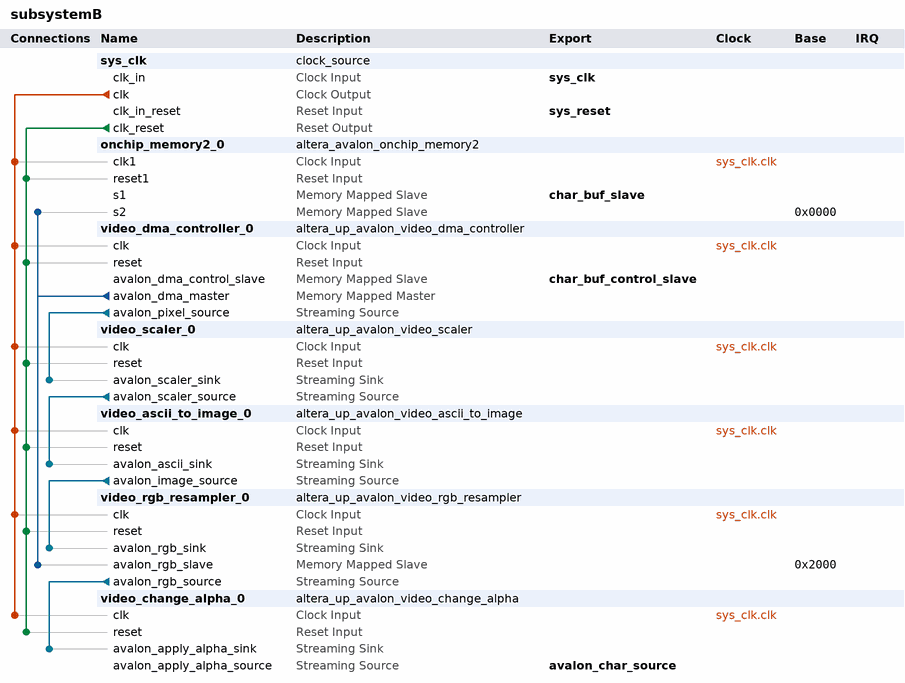
[diagram p0: system contents]
# Platform Designer (Qsys) system subsystemB, Cyclone IV E EP4CE115F29C7
# Parameters at their usual value, and those the tool derives, are not listed.
package require -exact qsys 18.0
create_system subsystemB
set_project_property DEVICE_FAMILY {Cyclone IV E}
set_project_property DEVICE EP4CE115F29C7

add_instance sys_clk clock_source 18.1
set_instance_parameter_value sys_clk clockFrequency 50000000
set_instance_parameter_value sys_clk clockFrequencyKnown false

add_instance onchip_memory2_0 altera_avalon_onchip_memory2 18.1
set_instance_parameter_value onchip_memory2_0 dataWidth 32
set_instance_parameter_value onchip_memory2_0 dualPort true
set_instance_parameter_value onchip_memory2_0 initMemContent true
set_instance_parameter_value onchip_memory2_0 initializationFileName onchip_mem.hex
set_instance_parameter_value onchip_memory2_0 memorySize 8192
set_instance_parameter_value onchip_memory2_0 singleClockOperation true

add_instance video_dma_controller_0 altera_up_avalon_video_dma_controller 18.0
set_instance_parameter_value video_dma_controller_0 addr_mode X-Y
set_instance_parameter_value video_dma_controller_0 back_start_address 150994944
set_instance_parameter_value video_dma_controller_0 color_bits 8
set_instance_parameter_value video_dma_controller_0 color_planes 1
set_instance_parameter_value video_dma_controller_0 dma_enabled true
set_instance_parameter_value video_dma_controller_0 height 60
set_instance_parameter_value video_dma_controller_0 mode {From Memory to Stream}
set_instance_parameter_value video_dma_controller_0 start_address 150994944
set_instance_parameter_value video_dma_controller_0 width 80

add_instance video_scaler_0 altera_up_avalon_video_scaler 18.0
set_instance_parameter_value video_scaler_0 color_bits 8
set_instance_parameter_value video_scaler_0 color_planes 1
set_instance_parameter_value video_scaler_0 height_in 60
set_instance_parameter_value video_scaler_0 height_scaling 8
set_instance_parameter_value video_scaler_0 include_channel true
set_instance_parameter_value video_scaler_0 width_in 80
set_instance_parameter_value video_scaler_0 width_scaling 8

add_instance video_ascii_to_image_0 altera_up_avalon_video_ascii_to_image 18.0
set_instance_parameter_value video_ascii_to_image_0 colour_format {1-bit Black/White}

add_instance video_rgb_resampler_0 altera_up_avalon_video_rgb_resampler 18.0
set_instance_parameter_value video_rgb_resampler_0 alpha 1023
set_instance_parameter_value video_rgb_resampler_0 input_type {1-bit Black/White}
set_instance_parameter_value video_rgb_resampler_0 output_type {40-bit RGBA}

add_instance video_change_alpha_0 altera_up_avalon_video_change_alpha 18.0
set_instance_parameter_value video_change_alpha_0 alpha 0
set_instance_parameter_value video_change_alpha_0 color 0
set_instance_parameter_value video_change_alpha_0 color_bits 10
set_instance_parameter_value video_change_alpha_0 color_planes 4

# connections
add_connection sys_clk.clk onchip_memory2_0.clk1 clock
add_connection sys_clk.clk video_ascii_to_image_0.clk clock
add_connection sys_clk.clk video_change_alpha_0.clk clock
add_connection sys_clk.clk video_dma_controller_0.clk clock
add_connection sys_clk.clk video_rgb_resampler_0.clk clock
add_connection sys_clk.clk video_scaler_0.clk clock
add_connection sys_clk.clk_reset onchip_memory2_0.reset1 reset
add_connection sys_clk.clk_reset video_ascii_to_image_0.reset reset
add_connection sys_clk.clk_reset video_change_alpha_0.reset reset
add_connection sys_clk.clk_reset video_dma_controller_0.reset reset
add_connection sys_clk.clk_reset video_rgb_resampler_0.reset reset
add_connection sys_clk.clk_reset video_scaler_0.reset reset
add_connection video_dma_controller_0.avalon_dma_master onchip_memory2_0.s2 avalon
set_connection_parameter_value video_dma_controller_0.avalon_dma_master/onchip_memory2_0.s2 baseAddress 0x0000
add_connection video_dma_controller_0.avalon_dma_master video_rgb_resampler_0.avalon_rgb_slave avalon
set_connection_parameter_value video_dma_controller_0.avalon_dma_master/video_rgb_resampler_0.avalon_rgb_slave baseAddress 0x2000
add_connection video_ascii_to_image_0.avalon_image_source video_rgb_resampler_0.avalon_rgb_sink avalon_streaming
add_connection video_dma_controller_0.avalon_pixel_source video_scaler_0.avalon_scaler_sink avalon_streaming
add_connection video_rgb_resampler_0.avalon_rgb_source video_change_alpha_0.avalon_apply_alpha_sink avalon_streaming
add_connection video_scaler_0.avalon_scaler_source video_ascii_to_image_0.avalon_ascii_sink avalon_streaming

# exported interfaces
add_interface avalon_char_source avalon_streaming source
set_interface_property avalon_char_source EXPORT_OF video_change_alpha_0.avalon_apply_alpha_source
add_interface char_buf_control_slave avalon slave
set_interface_property char_buf_control_slave EXPORT_OF video_dma_controller_0.avalon_dma_control_slave
add_interface char_buf_slave avalon slave
set_interface_property char_buf_slave EXPORT_OF onchip_memory2_0.s1
add_interface sys_clk clock sink
set_interface_property sys_clk EXPORT_OF sys_clk.clk_in
add_interface sys_reset reset sink
set_interface_property sys_reset EXPORT_OF sys_clk.clk_in_reset

set_interconnect_requirement {$system} qsys_mm.clockCrossingAdapter HANDSHAKE
set_interconnect_requirement {$system} qsys_mm.enableEccProtection FALSE
set_interconnect_requirement {$system} qsys_mm.insertDefaultSlave FALSE
set_interconnect_requirement {$system} qsys_mm.maxAdditionalLatency 1

save_system subsystemB.qsys
